# Altium schematic sheet Auxillary_Supply_UCC28740.SchDoc
size A2
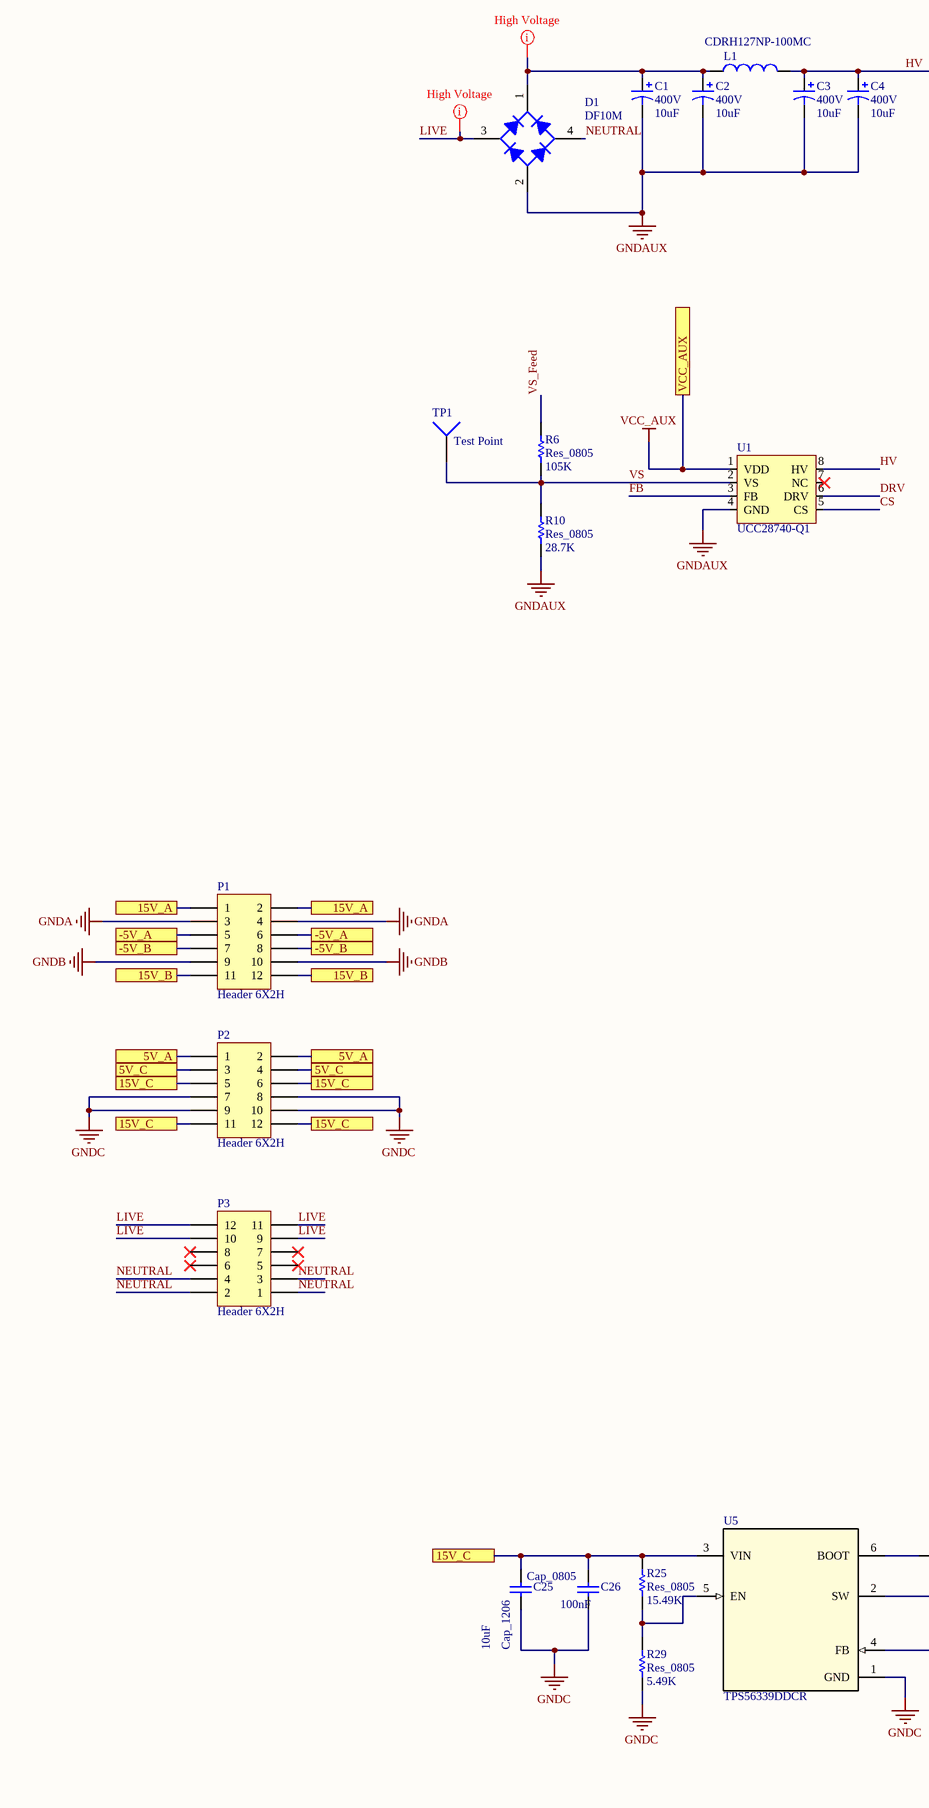
[diagram p0: Auxillary_Supply_UCC28740.SchDoc, left]
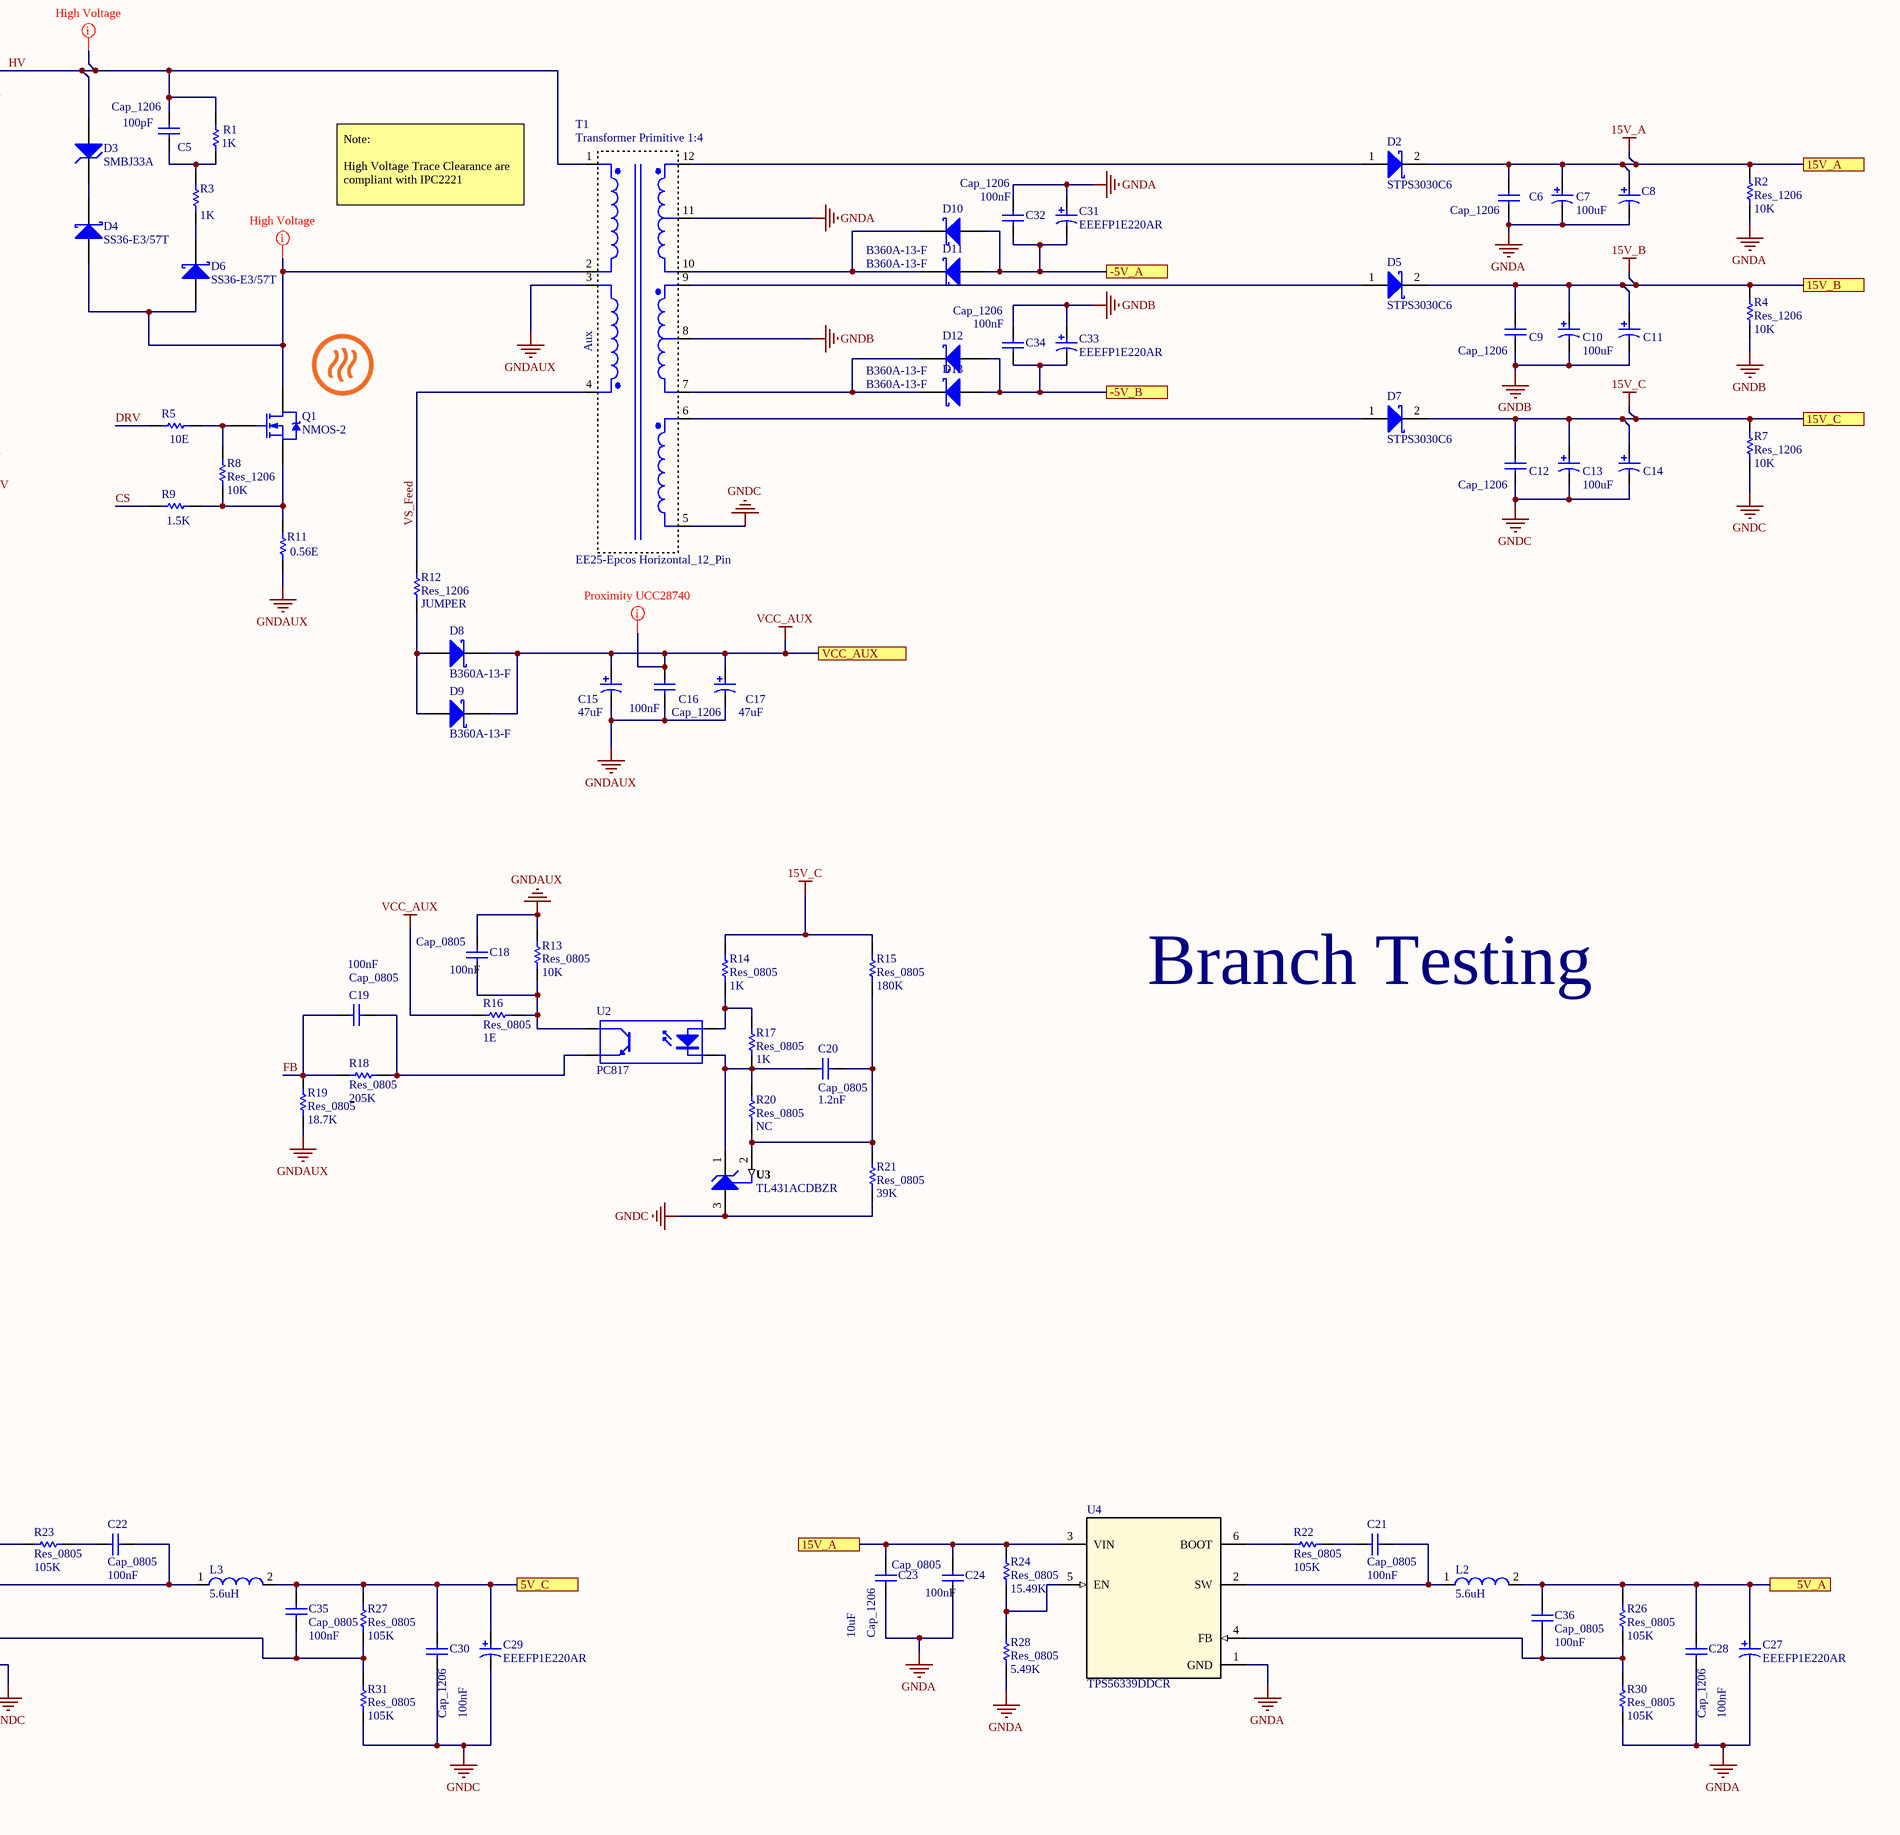
[diagram p1: Auxillary_Supply_UCC28740.SchDoc, right]

## Parts
C1  400V  value 10uF  [10uF_400V]
C2  400V  value 10uF  [10uF_400V]
C3  400V  value 10uF  [10uF_400V]
C4  400V  value 10uF  [10uF_400V]
C5  Cap_1206  value 100pF  [Chip_CAP_1206]
C6  Cap_1206  [Chip_CAP_1206]
C7  100uF  [PNSC-FK-V-F_V]
C8  100uF  [PNSC-FK-V-F_V]  (value not drawn)
C9  Cap_1206  [Chip_CAP_1206]
C10  100uF  [PNSC-FK-V-F_V]
C11  100uF  [PNSC-FK-V-F_V]  (value not drawn)
C12  Cap_1206  [Chip_CAP_1206]
C13  100uF  [PNSC-FK-V-F_V]
C14  100uF  [PNSC-FK-V-F_V]  (value not drawn)
C15  47uF  [PNSC-FP-V-D_V]
C16  Cap_1206  value 100nF  [Chip_CAP_1206]
C17  47uF  [PNSC-FP-V-D_V]
C18  Cap_0805  Size: 100nF  [Chip_CAP_0805]
C19  Cap_0805  Size: 100nF  [Chip_CAP_0805]
C20  Cap_0805  Size: 1.2nF  [Chip_CAP_0805]
C21  Cap_0805  Size: 100nF  [Chip_CAP_0805]
C22  Cap_0805  Size: 100nF  [Chip_CAP_0805]
C23  Cap_1206  value 10uF  [Chip_CAP_1206]
C24  Cap_0805  Size: 100nF  [Chip_CAP_0805]
C25  Cap_1206  value 10uF  [Chip_CAP_1206]
C26  Cap_0805  Size: 100nF  [Chip_CAP_0805]
C27  EEEFP1E220AR  [PNSC-FP-V-C_V]
C28  Cap_1206  value 100nF  [Chip_CAP_1206]
C29  EEEFP1E220AR  [PNSC-FP-V-C_V]
C30  Cap_1206  value 100nF  [Chip_CAP_1206]
C31  EEEFP1E220AR  [PNSC-FP-V-C_V]
C32  Cap_1206  value 100nF  [Chip_CAP_1206]
C33  EEEFP1E220AR  [PNSC-FP-V-C_V]
C34  Cap_1206  value 100nF  [Chip_CAP_1206]
C35  Cap_0805  Size: 100nF  [Chip_CAP_0805]
C36  Cap_0805  Size: 100nF  [Chip_CAP_0805]
D1  DF10M  [DF10M]
D2  STPS3030C6  [DPAK254P1542X450-4N]
D3  SMBJ33A  [FAIR-DO-214AA-2_V]
D4  SS36-E3/57T  [VISH-DO-214AB-2_V]
D5  STPS3030C6  [DPAK254P1542X450-4N]
D6  SS36-E3/57T  [VISH-DO-214AB-2_V]
D7  STPS3030C6  [DPAK254P1542X450-4N]
D8  B360A-13-F  [DIOD-B360A_V]
D9  B360A-13-F  [DIOD-B360A_V]
D10  B360A-13-F  [DIOD-B360A_V]
D11  B360A-13-F  [DIOD-B360A_V]
D12  B360A-13-F  [DIOD-B360A_V]
D13  B360A-13-F  [DIOD-B360A_V]
L1  CDRH127NP-100MC  [SUMI-CDRH127_V]
L2  5.6uH  [WE-PD-L]
L3  5.6uH  [WE-PD-L]
P1  Header 6X2H  [Header_6X2]
P2  Header 6X2H  [Header_6X2]
P3  Header 6X2H  [Header_6X2]
Q1  NMOS-2  [DPAK254P1542X450-3N - Thermal]
R1  value 1K  [Chip_Res_1206]  (hidden comment: Res_1206)
R2  Res_1206  value 10K  [Chip_Res_1206]
R3  value 1K  [Chip_Res_1206]  (hidden comment: Res_1206)
R4  Res_1206  value 10K  [Chip_Res_1206]
R5  value 10E  [Chip_Res_1206]  (hidden comment: Res_1206)
R6  Res_0805  value 105K  [Chip_Res_0805]
R7  Res_1206  value 10K  [Chip_Res_1206]
R8  Res_1206  value 10K  [Chip_Res_1206]
R9  value 1.5K  [Chip_Res_1206]  (hidden comment: Res_1206)
R10  Res_0805  value 28.7K  [Chip_Res_0805]
R11  value 0.56E  [Chip2PinSM127P600-8N_2512]  (hidden comment: Res_2512)
R12  Res_1206  value JUMPER  [Chip_Res_1206]
R13  Res_0805  value 10K  [Chip_Res_0805]
R14  Res_0805  value 1K  [Chip_Res_0805]
R15  Res_0805  value 180K  [Chip_Res_0805]
R16  Res_0805  value 1E  [Chip_Res_0805]
R17  Res_0805  value 1K  [Chip_Res_0805]
R18  Res_0805  value 205K  [Chip_Res_0805]
R19  Res_0805  value 18.7K  [Chip_Res_0805]
R20  Res_0805  value NC  [Chip_Res_0805]
R21  Res_0805  value 39K  [Chip_Res_0805]
R22  Res_0805  value 105K  [Chip_Res_0805]
R23  Res_0805  value 105K  [Chip_Res_0805]
R24  Res_0805  value 15.49K  [Chip_Res_0805]
R25  Res_0805  value 15.49K  [Chip_Res_0805]
R26  Res_0805  value 105K  [Chip_Res_0805]
R27  Res_0805  value 105K  [Chip_Res_0805]
R28  Res_0805  value 5.49K  [Chip_Res_0805]
R29  Res_0805  value 5.49K  [Chip_Res_0805]
R30  Res_0805  value 105K  [Chip_Res_0805]
R31  Res_0805  value 105K  [Chip_Res_0805]
T1  EE25-Epcos Horizontal_12_Pin  [PQ26_20]
TP1  Test Point  [PIN1]
U1  UCC28740-Q1  [SOIC127P570X175_HS-9N]
U2  PC817  [LTV-817]
U3  TL431ACDBZR  [DBZ0003A_L]
U4  TPS56339DDCR  [SOT95P278X110-6N]
U5  TPS56339DDCR  [SOT95P278X110-6N]

## Ports
5V_A, 5V_C, 15V_A, 15V_B, 15V_C, -5V_A, -5V_B, VCC_AUX

## Nets
15V_A: C6.2 C7.1 C8.1 C23.1 C24.1 D2.2(K) P1.1 P1.2 R2.2 R24.2 U4.3(VIN) ; port 15V_A
15V_B: C9.2 C10.1 C11.1 D5.2(K) P1.11 P1.12 R4.2 ; port 15V_B
15V_C: C12.2 C13.1 C14.1 C25.1 C26.1 D7.2(K) P2.5 P2.6 P2.11 P2.12 R7.2 R14.2 R15.1 R25.2 U5.3(VIN) ; port 15V_C
GNDA: C6.1 C7.2 C8.2 C23.2 C24.2 C27.2 C28.2 C31.1 C32.1 P1.3 P1.4 R2.1 R28.1 R30.1 T1.11 U4.1(GND)
GNDAUX: C1.2 C2.2 C3.2 C4.2 C15.2 C16.1 C17.2 C18.1 D1.2(A) R10.1 R11.1 R13.2 R19.1 T1.3 U1.4(GND)
GNDB: C9.1 C10.2 C11.2 C33.1 C34.1 P1.9 P1.10 R4.1 T1.8
GNDC: C12.1 C13.2 C14.2 C25.2 C26.2 C29.2 C30.2 P2.7 P2.8 P2.9 P2.10 R7.1 R21.1 R29.1 R31.1 T1.5 U3.3(ANODE) U5.1(GND)
VCC_AUX: C15.1 C16.2 C17.1 D8.2(K) D9.2(K) R16.2 U1.1(VDD) ; port VCC_AUX
5V_A: C27.1 C28.1 C36.2 L2.2 P2.1 P2.2 R26.2 ; port 5V_A
5V_C: C29.1 C30.1 C35.2 L3.2 P2.3 P2.4 R27.2 ; port 5V_C
-5V_A: C31.2 C32.2 D10.1(A) D11.1(A) P1.5 P1.6 ; port -5V_A
-5V_B: C33.2 C34.2 D12.1(A) D13.1(A) P1.7 P1.8 ; port -5V_B
CS: R9.1 U1.5(CS)
DRV: R5.1 U1.6(DRV)
FB: C19.2 R18.1 R19.2 U1.3(FB)
HV: C3.1 C4.1 C5.2 D3.1(A) L1.2 R1.2 T1.1 U1.8(HV)
LIVE: D1.3(C) P3.9 P3.10 P3.11 P3.12
NEUTRAL: D1.4(C) P3.1 P3.2 P3.3 P3.4
VS: R6.1 R10.2 TP1.1 U1.2(VS)
VS_Feed: R6.2 R12.2 T1.4
NetC1_1: C1.1 C2.1 D1.1(K) L1.1
NetC5_1: C5.1 R1.1 R3.2
NetC18_2: C18.2 R13.1 R16.1 U2.4(C)
NetC19_1: C19.1 R18.2 U2.3(E)
NetC20_1: C20.1 R17.1 R20.2 U2.2(K) U3.1(CATHODE)
NetC20_2: C20.2 R15.2 R20.1 R21.2 U3.2(REF)
NetC21_1: C21.1 R22.1
NetC21_2: C21.2 L2.1 U4.2(SW)
NetC22_1: C22.1 R23.1
NetC22_2: C22.2 L3.1 U5.2(SW)
NetC35_1: C35.1 R27.1 R31.2 U5.4(FB)
NetC36_1: C36.1 R26.1 R30.2 U4.4(FB)
NetD2_1: D2.1(A) T1.12
NetD3_2: D3.2(K) D4.2(K)
NetD4_1: D4.1(A) D6.1(A) Q1.2(D) T1.2
NetD5_1: D5.1(A) T1.9
NetD6_2: D6.2(K) R3.1
NetD7_1: D7.1(A) T1.6
NetD8_1: D8.1(A) D9.1(A) R12.1
NetD10_2: D10.2(K) D11.2(K) T1.10
NetD12_2: D12.2(K) D13.2(K) T1.7
NetQ1_1: Q1.1(G) R5.2 R8.2
NetQ1_3: Q1.3(S) R8.1 R9.2 R11.2
NetR14_1: R14.1 R17.2 U2.1(A)
NetR22_2: R22.2 U4.6(BOOT)
NetR23_2: R23.2 U5.6(BOOT)
NetR24_1: R24.1 R28.2 U4.5(EN)
NetR25_1: R25.1 R29.2 U5.5(EN)

Not connected (* = marked no-connect by the designer): P3 5* 6* 7* 8*; U1 7(NC)

## Layout directives
mark named Proximity UCC28740: VCC_AUX
Parameter 1: *Hv; rule Clearance Constraint [Generic clearance = 40mil, and 6 value(s) for objects]; net class HV: HV, LIVE, NetC1_1, NetD4_1

## Notes on the sheet
- Note:
  High Voltage Trace Clearance are compliant with IPC2221
- Branch Testing
- (in symbol EE25-Epcos Horizontal_12_Pin) Transformer Primitive 1:4; Aux

## Library data of the parts
C1-C4 = Cap Pol1: Polarized Capacitor (Radial); Published: 8-Jun-2000; LatestRevisionDate: 17-Jul-2002; LatestRevisionNote: Re-released for DXP Platform.; PackageReference: RB7.6-15; Publisher: Altium Limited; PackageDescription: Polarized Capacitor (Radial); 2 Leads
C5 C16 C23 C25 C28 C30 C32 C34 = Cap: Capacitor; Published: 8-Jun-2000; LatestRevisionDate: 17-Jul-2002; LatestRevisionNote: Re-released for DXP Platform.; PackageReference: RAD-0.3; Publisher: Altium Limited; PackageDescription: Radial Cap, Thru-Hole; 2 Leads; 0.3 in Pin Spacing
C6 C9 C12 C18-C22 C24 C26 C35 C36 = Cap: Capacitor; Value: 100pF; Published: 8-Jun-2000; LatestRevisionDate: 17-Jul-2002; LatestRevisionNote: Re-released for DXP Platform.; PackageReference: RAD-0.3; Publisher: Altium Limited; PackageDescription: Radial Cap, Thru-Hole; 2 Leads; 0.3 in Pin Spacing
C7 C8 C10 C11 C13 C14 = CMP-2000-06208-1: Aluminum Electrolytic Capacitor, 100 uF, +/- 20%, 50 V, 2-Pin SMD (Size Code F), -55 to 105 degC, RoHS, Tape and Reel; Manufacturer: Panasonic; Impedance: 0.34O; Lifetime@Temperature: 2000Hrs@105°C; Ripple Current: 350mA; Type: Can; Rated Voltage: 50V; Capacitance: 100µF; Mounting Technology: SurfaceMount; Series: FK; Package URL: http://industrial.panasonic.com/cdbs/www-data/pdf/RDE0000/DME0000COL48.pdf; Datasheet URL: http://industrial.panasonic.com/cdbs/www-data/pdf/RDE0000/ABA0000C1181.pdf; Package Reference: FK-V-F; Operating Temp-Max: 105°C; Manufacturer URL: http://www.panasonic.com/; Operating Temp Range: -55to+105°C; Package Description: 2-Pin Electrolytic Aluminum Capacitor, Body 8.3 x 8.3 mm; Datasheet Version: 03/2016; Case Size/Dimension: Ø8x10.2mm
C15 C17 = CMP-2000-06216-1: Aluminum Electrolytic Capacitor, 47 uF, +/- 20%, 35 V, 2-Pin SMD (Size Code D), -55 to 105 degC, RoHS, Tape and Reel; Manufacturer: Panasonic; Lifetime@Temperature: 2000Hrs@105°C; Capacitance: 47µF; Type: Can; Rated Voltage: 35V; Ripple Current: 300mA; ESR (Equivalent Series Resistance): 0.26O; Package Reference: FP-V-D; Package Description: 2-Pin Electrolytic Aluminum Capacitor, Body 6.6 x 6.6 mm; Datasheet URL: http://industrial.panasonic.com/cdbs/www-data/pdf/RDE0000/ABA0000C1184.pdf; Series: FP; Operating Temp Range: -55to+105°C; Operating Temp-Max: 105°C; Datasheet Version: 03/2016; Manufacturer URL: http://www.panasonic.com/; Package URL: http://industrial.panasonic.com/cdbs/www-data/pdf/RDE0000/DME0000COL48.pdf; Case Size/Dimension: Ø6.3x5.8mm; Mounting Technology: SurfaceMount
C27 C29 C31 C33 = CMP-2000-06213-1: Aluminum Electrolytic Capacitor, 22 uF, +/- 20%, 25 V, 2-Pin SMD (Size Code C), -55 to 105 degC, RoHS, Tape and Reel; Manufacturer: Panasonic; ESR (Equivalent Series Resistance): 0.36O; Ripple Current: 240mA; Capacitance: 22µF; Lifetime@Temperature: 2000Hrs@105°C; Rated Voltage: 25V; Type: Can; Package Reference: FP-V-C; Package Description: 2-Pin Electrolytic Aluminum Capacitor, Body 5.3 x 5.3 mm; Operating Temp Range: -55to+105°C; Mounting Technology: SurfaceMount; Datasheet URL: http://industrial.panasonic.com/cdbs/www-data/pdf/RDE0000/ABA0000C1184.pdf; Case Size/Dimension: Ø5x5.8mm; Operating Temp-Max: 105°C; Package URL: http://industrial.panasonic.com/cdbs/www-data/pdf/RDE0000/DME0000COL48.pdf; Datasheet Version: 03/2016; Series: FP; Manufacturer URL: http://www.panasonic.com/
D2 D5 D7 = 11DQ06: Schottky Rectifier; Published: 8-Jun-2000; LatestRevisionDate: 17-Jul-2002; LatestRevisionNote: Re-released for DXP Platform.; DatasheetVersion: Dec-1997; PackageReference: DO-204AL; Publisher: Altium Limited; PackageDescription: Diode, Axial; Body 5.2 x 2.7 mm (LxDia. max), Lead Dia. 0.86 mm (max); Code_JEDEC: DO-204-AL; ComponentLink1Description: Manufacturer Link; ComponentLink1URL: http://www.irf.com/; ComponentLink2Description: Datasheet; ComponentLink2URL: http://www.irf.com/product-info/datasheets/data/11dq05.pdf
D3 = CMP-2000-07095-1: Transient Voltage Suppressor, 600 W, 33 V, -55 to 150 degC, 2-Pin SMD, RoHS, Tape and Reel; Manufacturer: FairchildSemiconductor; Test Current: 1mA; Maximum Clamping Voltage: 53.3V; Direction Type: Uni-Directional; Rad Hard: No; Configuration: Single; Maximum Peak Pulse Current: 11.3A; Minimum Breakdown Voltage: 36.7V; Maximum Reverse Stand-off Voltage: 33V; Maximum Reverse Leakage Current: 5uA; Peak Pulse Power Dissipation: 600W; Package: 2DO-214AA; Mounting Technology: SurfaceMount; Manufacturer URL: https://www.fairchildsemi.com/; Category: TVS; Package Reference: DO-214AA-2; Operating Temperature: -55to150°C; Packaging: Tape&Reel; Datasheet Version: Rev. 1.1.1, 11/2014; Package Description: 2-Pin Surface Mount Device, Body 4.4 x 3.625 mm; Datasheet URL: https://www.fairchildsemi.com/datasheets/SM/SMBJ33A.pdf; Mounting: SurfaceMount
D4 D6 = CMP-2000-07150-1: Surface Mount Schottky Barrier Rectifier, 60 V, 3 A, -55 to 150 degC, 2-Pin SMC (DO-214AB), RoHS, Tape and Reel; Manufacturer: Vishay; Forward Current If(AV): 3A; Diode Configuration: Single; Forward Surge Current Ifsm Max: 100A; SVHC: ToBeAdvised; No. of Pins: 2Pins; Forward Voltage VF Max: 750mV; Repetitive Reverse Voltage Vrrm Max: 60V; Datasheet URL: http://www.vishay.com/docs/88751/ss32.pdf; Datasheet Version: 08/2015; Manufacturer URL: http://www.vishay.com/; Diode Type: Schottky; Package Reference: DO-214AB; Mounting Technology: SurfaceMount; Diode Case Style: DO-214AB; Package Description: 2-Pin Surface Mount Device, Body 6.855 x 5.905 mm; Packaging: CutTape; Operating Temperature Max: 150°C; Product Range: -
D8-D13 = CMP-2000-05898-1: Schottky Barrier Rectifier, 3 A, -55 to 150 degC, 2-Pin Molded, RoHS, Tape and Reel; Manufacturer: DiodesIncorporated; Vf - Forward Voltage: 0.7V; Ifsm - Forward Surge Current: 80A; If - Forward Current: 3A; Unit Weight: 0.002258oz; Ir - Reverse Current: 500uA; Vrrm - Repetitive Reverse Voltage: 60V; Configuration: Single; Length: 4.6mm; Datasheet Version: Rev. 15-2, 09/2014; Technology: Si; Factory Pack Quantity: 5000; Manufacturer URL: http://www.diodes.com/; Type: SchottkyBarrierRectifier; Product Category: SchottkyDiodes&Rectifiers; Minimum Operating Temperature: -55C; Packaging: Reel; Product: SchottkyDiodes; Height: 2.3mm; Datasheet URL: https://datasheet.ciiva.com/914/ds30891-914080.pdf; Series: B360; Brand: DiodesIncorporated; Maximum Operating Temperature: +125C; Termination Style: SMD/SMT; Package / Case: SMA; Mounting Style: SMD/SMT; RoHS: True; Package Description: 2-Pin Surface Mount Device, Body 4.3 x 2.605 mm; Operating Temperature Range: -55Cto+125C; Package Reference: B360A; Width: 2.92mm; Mounting Technology: SurfaceMount
L1 = CMP-2000-06084-1: Power Inductor, 10 uH, +/- 20%, -40 to 100 degC, 2-Pin SMD, RoHS, Tape and Reel; Manufacturer: Sumida; Catalog Drawings: CDRH127SeriesFrontCDRH127SeriesSideCDRH127SeriesBottom; Product Training Modules: PowerInductorBasics; Current Rating: 5.4A; Shielding: Shielded; Online Catalog: CDRHSeries; DC Resistance (DCR): 21.6mOhmMax; Other Names: 308-1457-1; Inductance: 10µH; Frequency - Test: 1kHz; Mounting Type: SurfaceMount; Datasheet Version: 01/2014; Package Description: 2-Pin Surface Mount Device, Body 12 x 12 mm; Frequency - Self Resonant: -; Package Reference: CDRH127; Category: Inductors,Coils,Chokes; Material - Core: -; Q @ Freq: -; Type: -; Family: FixedInductors; Ratings: -; Series: CDRH127; Manufacturer URL: http://www.sumida.com/; Operating Temperature: -40°C~100°C; Height - Seated (Max): 0.315"(8.00mm); Standard Package: 1; Size / Dimension: 0.472"Lx0.472"W(12.00mmx12.00mm); Current - Saturation: -; Datasheet URL: http://products.sumida.com/products/pdf/CDRH127.pdf; Package / Case: Nonstandard; Tolerance: ±20%; Mounting Technology: SurfaceMount; Packaging: CutTape(CT)
L2 L3 = CMP-0227-00698-1: SMD-Shielded Power Inductor WE-PD, L = 4.70 µH; Inductance: 4.70 ÂµH; ComponentLink1Description: Manufacturer Link; ComponentLink2Description: Datasheet; ComponentLink2URL: http://www.we-online.de/katalog/media/pdf/744771004.pdf; PackageReference: WE-PD-L; ComponentLink1URL: http://www.we-online.com; DatasheetVersion: ver 7, Sep-2006; PackageDescription: SMD Inductor, 2-Leads, Body 12.0 x 12.0 mm; PackageVersion: 2006
P1-P3 = Header 6X2H: Header, 6-Pin, Dual row, Right Angle; LatestRevisionDate: 17-Jul-2002; LatestRevisionNote: Re-released for DXP Platform.; Publisher: Altium Limited
Q1 = NMOS-2: N-Channel Power MOSFET; Note: Pin 2 is electrically connected to pin 4.; Published: 8-Jun-2000; LatestRevisionDate: 17-Jul-2002; LatestRevisionNote: Re-released for DXP Platform.; DatasheetVersion: PD-9.814; PackageVersion: Feb-1997; PackageReference: TO-220AB; Publisher: Altium Limited; PackageDescription: TO, Thru-Hole, Vertical, Heatsink Mounted; 3 In-Line Leads; Pitch 2.54 mm; ComponentLink1Description: Manufacturer Link; ComponentLink1URL: http://www.irf.com/
R1-R31 = Res1: Resistor; Published: 8-Jun-2000; LatestRevisionDate: 17-Jul-2002; LatestRevisionNote: Re-released for DXP Platform.; PackageReference: AXIAL-0.3; Publisher: Altium Limited; PackageDescription: Axial Device, Thru-Hole; 2 Leads; 0.3 in Pin Spacing
TP1 = Socket: LatestRevisionDate: 17-Jul-2002; LatestRevisionNote: Re-released for DXP Platform.; Publisher: Altium Limited
U2 = Optoisolator1: 4-Pin Phototransistor Optocoupler; Published: 24-Mar-1999; LatestRevisionDate: 04-Mar-2005; LatestRevisionNote: Sch pins 3 & 4 Swapped.; DatasheetVersion: Nov-2003; PackageReference: DIP-4; Publisher: Altium Limited
U3 = CMP-0366-01028-2: Adjustable Precision Shunt Regulator, 34 ppm / degC, 100 mA, 0 to 70 degC, 3-pin SOT-23 (DBZ), Green (RoHS & no Sb/Br); Manufacturer: Texas Instruments; Min Iz for Regulation(uA): 600; Rating: Catalog; Initial Accuracy @ 25/deg C(%): 1; VO Adj(Min)(V): 2.495; Temp Coeff(Typ)(ppm/ degree C): 34; VO Adj(Max)(V): 36; Iout/Iz(Max)(mA): 100; SubFamily: Shunt Voltage Reference; PartNumber: TL431ACDBZR; PackageReference: DBZ0003A; ComponentLink1URL: http://www.ti.com/; Mounting Technology: Surface Mount; ComponentLink2Description: Datasheet; ComponentLink3URL: http://www.ti.com/litv/pdf/mpds108a; ComponentLink2URL: http://www.ti.com/general/docs/lit/getliterature.tsp?genericPartNumber=TL431A&fileType=pdf; PackageVersion: 4203227/B; Code_JEDEC: TO-236; PackageDescription: 3-Pin Plastic Small Outline, Body 2.92 x 1.3 mm, Pitch 0.95 mm; DatasheetVersion: SLVS543M; Eco-Plan: Green (RoHS & no Sb/Br); ComponentLink1Description: Manufacturer URL; ComponentLink3Description: Package Specification
U4 U5 = TPS56339DDCR: Imported; Manufacturer: Texas Instruments; PartNumber: TPS56339DDCR; RefDes: RefDes; TYPE: TYPE; Value: Value; Manufacturer_Part_Number: TPS56339DDCR; Manufacturer_Name: Texas Instruments